# EAGLE schematic vswitch (EAGLE 8.4.0)
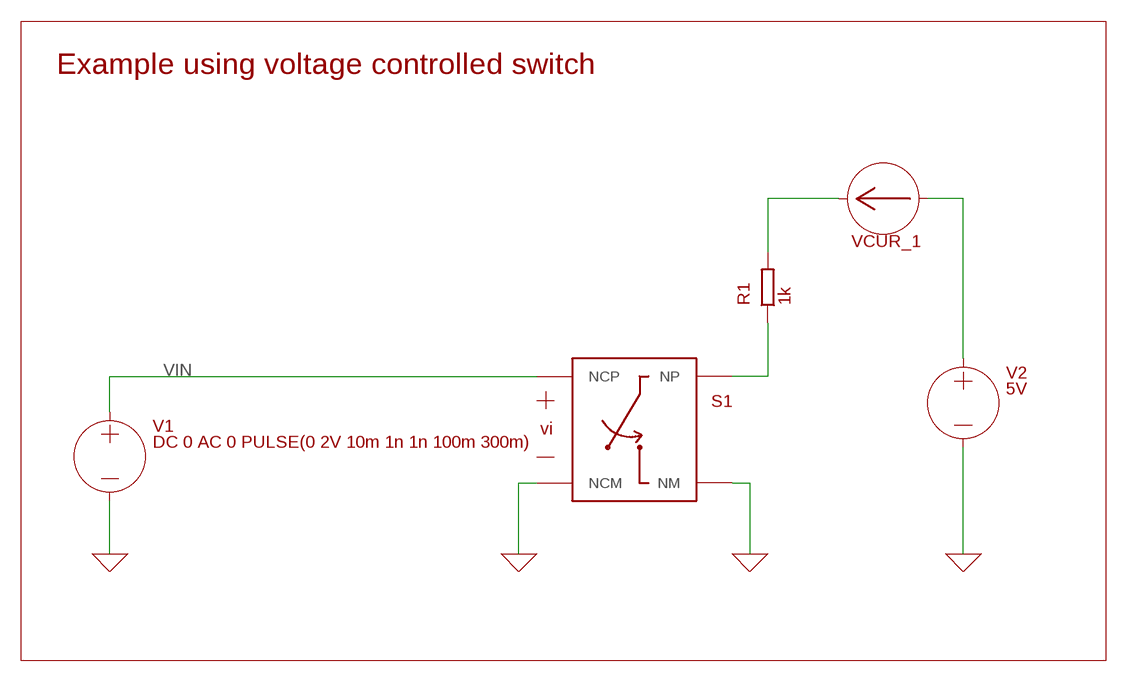
[diagram p0: schematic, sheet 1]

## Parts
R1  1k  R  (no package)
S1  V_SWITCH  (no package)
V1  DC 0 AC 0 PULSE(0 2V 10m 1n 1n 100m 300m)  VOLTAGE  (no package)
V2  5V  VOLTAGE  (no package)
VCUR_1  0V  AMMETER  (no package)

## Nets
0: S1.NCM S1.NM V1.- V2.- ; supply symbol labelled GND
N$1: V2.+ VCUR_1.+
N$2: R1.1 S1.NP
N$3: R1.2 VCUR_1.-
VIN: S1.NCP V1.+

## Notes on the sheet
- Example using voltage controlled switch

## Library data of the parts
R1 = ngspice-simulation:R: RESISTOR
S1 = ngspice-simulation:V_SWITCH: Voltage controlled Switch; SPICEEXTRA: OFF
V1 V2 = ngspice-simulation:VOLTAGE: Independent Voltage Source, either DC, AC, PULSE, SINE, PWL, EXP, or SFFM; VALUE: 0V
VCUR_1 = ngspice-simulation:AMMETER: AMMETER